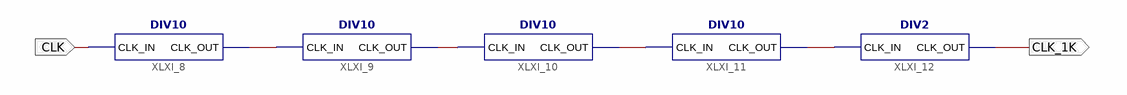
[diagram p0: schematic sheet 1]
// Xilinx ISE schematic DIV20K.sch (spartan6) as structural Verilog: 5 symbols, 2 ports
module DIV20K (
  input  CLK,
  output CLK_1K
);

  wire XLXN_1, XLXN_2, XLXN_3, XLXN_4;

  DIV10 XLXI_8 (.CLK_IN(CLK), .CLK_OUT(XLXN_1));
  DIV10 XLXI_9 (.CLK_IN(XLXN_1), .CLK_OUT(XLXN_2));
  DIV10 XLXI_10 (.CLK_IN(XLXN_2), .CLK_OUT(XLXN_3));
  DIV10 XLXI_11 (.CLK_IN(XLXN_3), .CLK_OUT(XLXN_4));
  DIV2 XLXI_12 (.CLK_IN(XLXN_4), .CLK_OUT(CLK_1K));
endmodule
